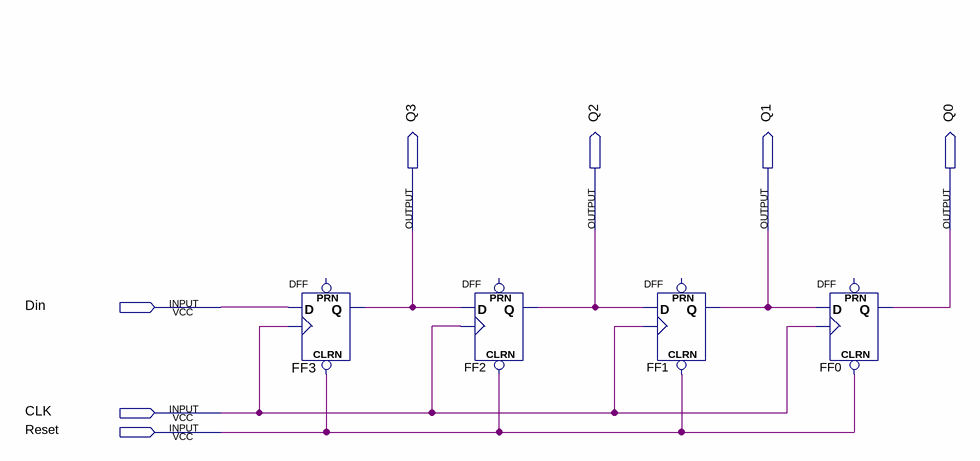
[diagram p0: schematic sheet]
// Quartus schematic work3.bdf as structural Verilog: 4 symbols, 7 pins
module work3 (
  input  Din,
  input  CLK,
  input  Reset,
  output Q3,
  output Q2,
  output Q1,
  output Q0
);

  DFF FF3 (.CLRN(Reset), .CLK(CLK), .D(Din), .Q(Q3));  // open: PRN
  DFF FF2 (.CLRN(Reset), .CLK(CLK), .D(Q3), .Q(Q2));  // open: PRN
  DFF FF1 (.CLRN(Reset), .CLK(CLK), .D(Q2), .Q(Q1));  // open: PRN
  DFF FF0 (.CLRN(Reset), .CLK(CLK), .D(Q1), .Q(Q0));  // open: PRN
endmodule
